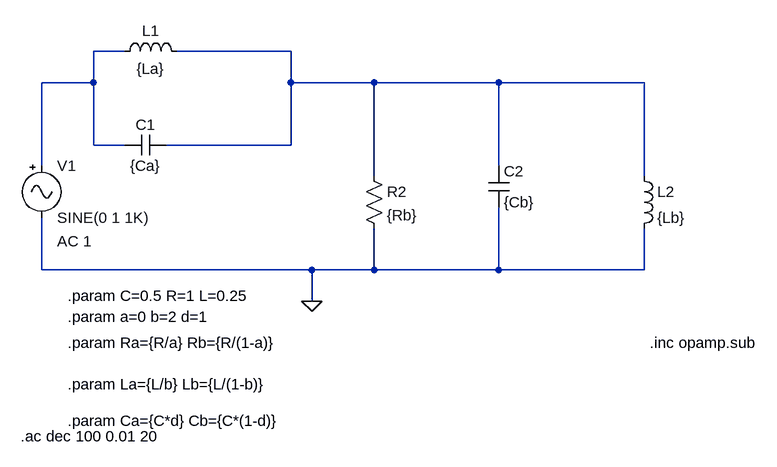
[diagram p0: schematic TS5-Ej2-d.asc]
TS5-Ej2-d.asc, the LTspice schematic file:
Version 4
SHEET 1 1328 680
WIRE 64 32 16 32
WIRE 320 32 144 32
WIRE 16 80 16 32
WIRE 16 80 -64 80
WIRE 320 80 320 32
WIRE 448 80 320 80
WIRE 640 80 448 80
WIRE 864 80 640 80
WIRE 16 176 16 80
WIRE 64 176 16 176
WIRE 320 176 320 80
WIRE 320 176 128 176
WIRE -64 208 -64 80
WIRE 640 208 640 80
WIRE 448 224 448 80
WIRE 864 224 864 80
WIRE -64 368 -64 288
WIRE 352 368 -64 368
WIRE 448 368 448 304
WIRE 448 368 352 368
WIRE 640 368 640 272
WIRE 640 368 448 368
WIRE 864 368 864 304
WIRE 864 368 640 368
WIRE 352 416 352 368
FLAG 352 416 0
SYMBOL ind 48 48 R270
WINDOW 0 32 56 VTop 2
WINDOW 3 5 56 VBottom 2
SYMATTR InstName L1
SYMATTR Value {La}
SYMBOL cap 128 160 R90
WINDOW 0 0 32 VBottom 2
WINDOW 3 32 32 VTop 2
SYMATTR InstName C1
SYMATTR Value {Ca}
SYMBOL res 432 208 R0
SYMATTR InstName R2
SYMATTR Value {Rb}
SYMBOL Misc\\signal -64 192 R0
WINDOW 123 24 132 Left 2
WINDOW 39 0 0 Left 0
SYMATTR Value2 AC 1
SYMATTR InstName V1
SYMBOL cap 624 208 R0
SYMATTR InstName C2
SYMATTR Value {Cb}
SYMBOL ind 848 208 R0
SYMATTR InstName L2
SYMATTR Value {Lb}
TEXT -24 480 Left 2 !.param Ra={R/a} Rb={R/(1-a)}
TEXT -24 544 Left 2 !.param La={L/b} Lb={L/(1-b)}
TEXT -24 600 Left 2 !.param Ca={C*d} Cb={C*(1-d)}
TEXT -24 440 Left 2 !.param a=0 b=2 d=1
TEXT -24 408 Left 2 !.param C=0.5 R=1 L=0.25
TEXT -96 624 Left 2 !.ac dec 100 0.01 20
TEXT 872 480 Left 2 !.inc opamp.sub

The netlist it stands for:
* TS5-Ej2-d.asc
L1 N001 N002 {La}
C1 N002 N001 {Ca}
R2 N002 0 {Rb}
V1 N001 0 SINE(0 1 1K) AC 1
C2 N002 0 {Cb}
L2 N002 0 {Lb}
.param Ra={R/a} Rb={R/(1-a)}
.param La={L/b} Lb={L/(1-b)}
.param Ca={C*d} Cb={C*(1-d)}
.param a=0 b=2 d=1
.param C=0.5 R=1 L=0.25
.ac dec 100 0.01 20
.inc opamp.sub
.backanno
.end